# Altium schematic sheet VoltageDetect.SchDoc
size A4; Date: 04.01.2021; Organization: Altium Limited; Address1: L3, 12a Rodborough Rd; Address2: Frenchs Forest; Address3: NSW; Address4: Australia 2086; SheetNumber: 3; SheetTotal: 3; Название устройства: Voltage_Detection_Reciever; Version: 1
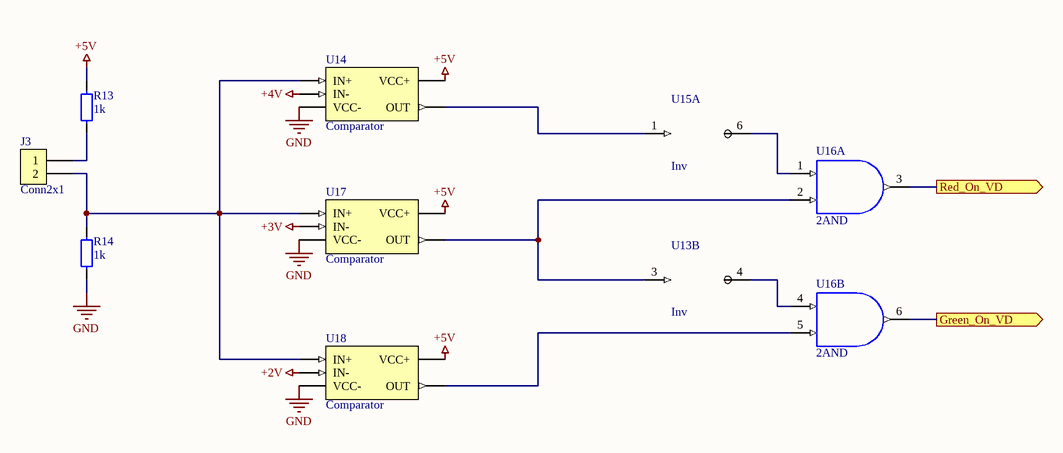
[diagram p0: VoltageDetect.SchDoc]

## Parts
J3  Conn2x1  [MolexMicroFit 2x1]
R13  1k  [0603 Resistor]
R14  1k  [0603 Resistor]
U13  Inv  (part B of 3)
U14  Comparator  [SOT-23-5]
U15  Inv  (part A of 3)
U16  2AND  [Dip14]  (parts A,B of 5)
U17  Comparator  [SOT-23-5]
U18  Comparator  [SOT-23-5]

## Ports
Green_On_VD (out), Red_On_VD (out)

## Nets
+2V: U18.4(IN-)
+3V: U17.4(IN-)
+4V: U14.4(IN-)
+5V: R13.2 U14.5(VCC+) U17.5(VCC+) U18.5(VCC+)
GND: R14.1 U14.2(VCC-) U17.2(VCC-) U18.2(VCC-)
Green_On_VD: U16.6(2Y) ; port Green_On_VD
Red_On_VD: U16.3(1Y) ; port Red_On_VD
NetJ3_1: J3.1 R13.1
NetJ3_2: J3.2 R14.2 U14.3(IN+) U17.3(IN+) U18.3(IN+)
NetU13_3: U13.3(A) U16.2(1B) U17.1(OUT)
NetU13_4: U13.4(Y) U16.4(2A)
NetU14_1: U14.1(OUT) U15.1(A)
NetU15_6: U15.6(Y) U16.1(1A)
NetU16_5: U16.5(2B) U18.1(OUT)

## Notes on the sheet
- Size:
- Date:
- A4
- Car#:
- Time:
- 418
- Team:
- Sheet
- BRT
- of
- University:
- Technical University
- Bauman Moscow State
- Document Version:

## Library data of the parts
J3 = Conn 2 [MicroFit]: Micro-Fit 3.0 Right-Angle Header, 3.00mm Pitch, Single Row, 2 Circuits, with Snap-in Plastic Peg PCB Lock, Tin, Glow-Wire Capable, Black; Part Number: 436500200; Manufacturer: Molex; ComponentLink1Description: Molex; ComponentLink1URL: https://www.molex.com/molex/products/part-detail/pcb_headers/0436500200; Type: Connector
R13 R14 = Res 1k (0603): 0.1W 0603 1k, 1%; Part Number: RC0603FR-071KL; Manufacturer: Taiwan; Type: Resistor; ComponentLink1Description: Chip&Dip; ComponentLink1URL: https://www.chipdip.ru/product0/9000079676
U13 U15 = Inverter: Chip&Dip: https://www.chipdip.ru/product/sn74lvc2g04dbvr-2
U14 U17 U18 = Comparator [LMV]: LMV7219 7-ns 2.7-V to 5-V Comparator with Rail-to-Rail Output; Part Number: LMV7219M5X/NOPB; Manufacturer: Texas Instruments; ComponentLink1Description: DataSheet; ComponentLink1URL: http://www.ti.com/lit/ds/symlink/lmv7219.pdf; ComponentLink2Description: Mouser; ComponentLink2URL: https://ru.mouser.com/ProductDetail/Texas-Instruments/LMV7219M5X-NOPB?qs=sGAEpiMZZMuayl%2FEk2kXcbEcxwmoPguctVQUIBgrLJY%3D; Type: IC
U16 = 4(2AND): Quadruple 2-Input Positive-AND Gates, N0014A, TUBE; ComponentLink1Description: CHIPDIP; ComponentLink1URL: https://www.chipdip.ru/product/sn74als08n; ComponentLink2Description: Datasheet; ComponentLink2URL: https://static.chipdip.ru/lib/205/DOC000205515.pdf